# EAGLE design HeadlightPCB (EAGLE 9.5.0)
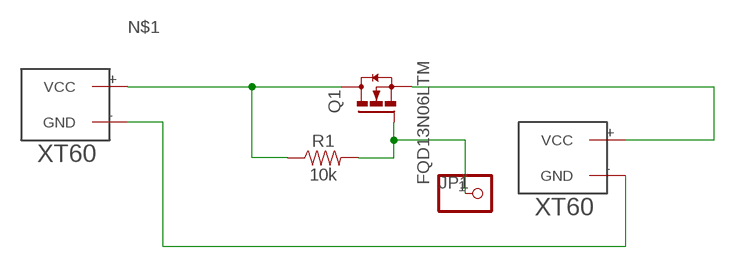
[diagram p0: schematic, sheet 1]

## Parts
JP1  PINHD-1X1  [1X01]
Q1  FQD13N06LTM  [DPAK4]
R1  10k  10KOHM-0603-1/10W-1%  [0603]
U$2  XT60  [XT60]
VIN  XT60  [XT60]

## Nets
N$1: Q1.2(D) Q1.4(D) R1.1 VIN.+(VCC)
N$3: Q1.3(S) U$2.+(VCC)
N$4: U$2.-(GND) VIN.-(GND)
N$5: JP1.1 Q1.1(G) R1.2

## Library data of the parts
JP1 = adafruit:PINHD-1X1: Pin header 1x1 for 0.1" spacing With round pins
Q1 = Transistor:FQD13N06LTM: MOSFET N-CH 60V 11A DPAK Manufacturer's datasheet <https://www.onsemi.com/pub/Collateral/FQU13N06L-D.PDF>; CREATED_BY: PCBLayout.com; DIGIKEY_PART_NUMBER: FQD13N06LTMCT-ND; MANUFACTURER: ON Semiconductor; MPN: FQD13N06LTM; PACKAGE: DPAK-4
R1 = SparkFun-Resistors:10KOHM: 10kΩ resistor A resistor is a passive two-terminal electrical component that implements electrical resistance as a circuit element. Resistors act to reduce current flow, and, at the same time, act to lower voltage levels within circuits. - Wikipedia; PROD_ID: RES-00824
U$2 VIN = XT60:XT60: XT60

## Board
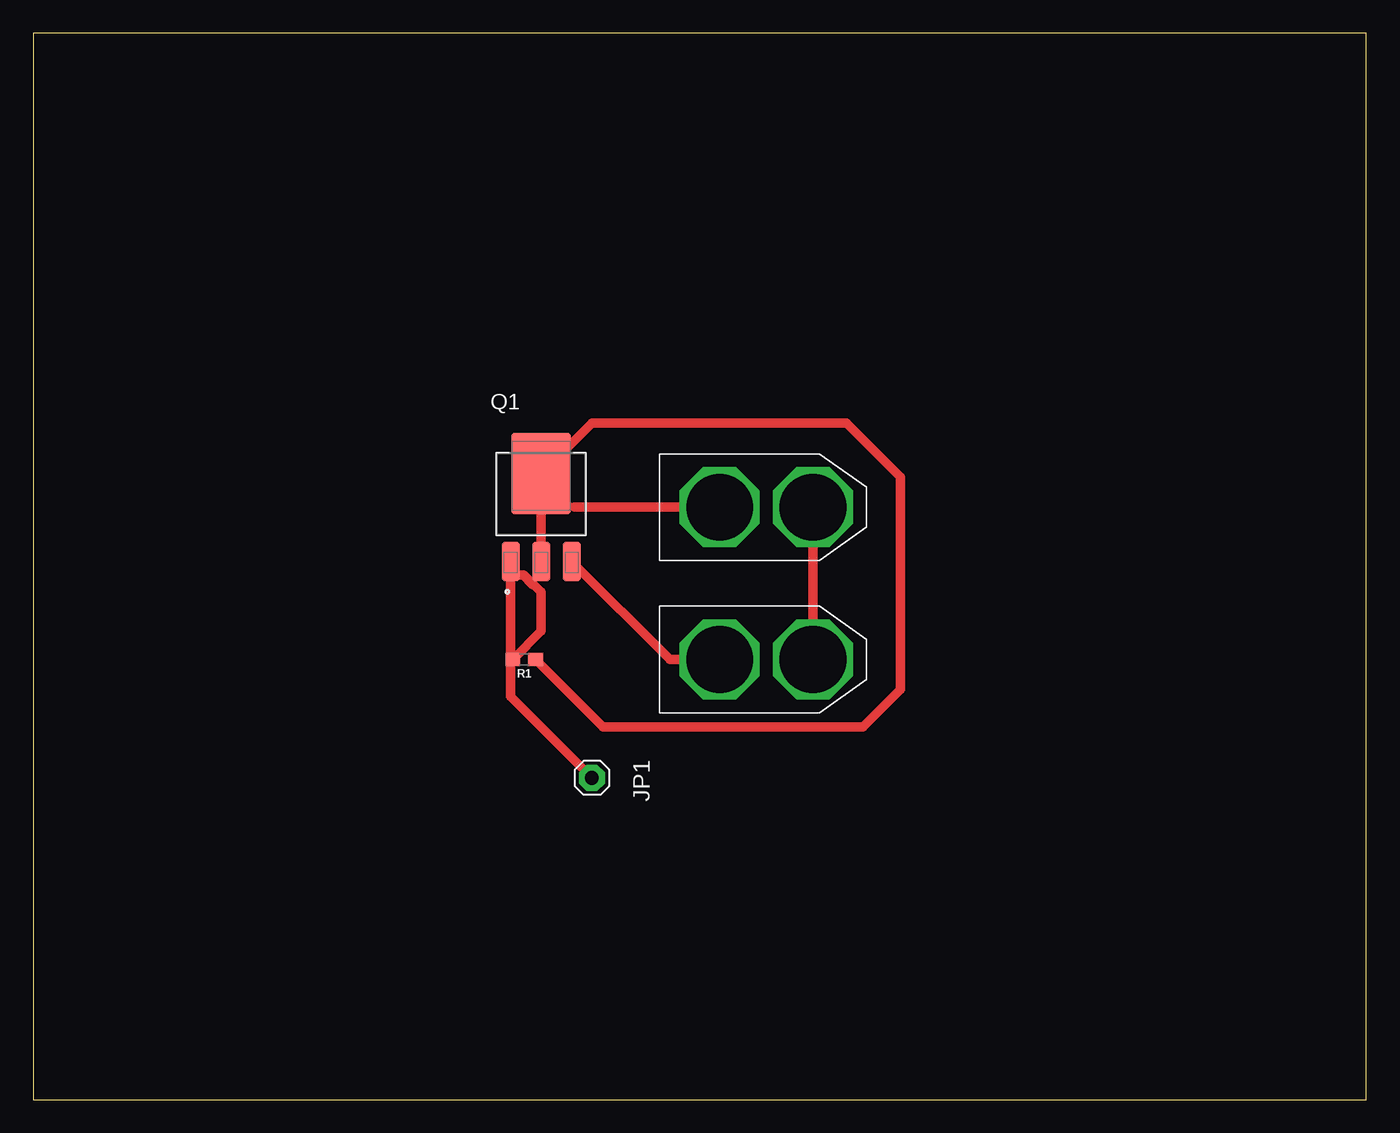
[diagram p1: board, top side]

Size 100 x 80 mm. Coordinates in mm from the lower left corner, seen from the top.
Outline: 0,0 100,0 100,80 0,80 0,0
Copper layers (1*16): Top 0.035mm / dielectric 1.5mm / Bottom 0.035mm
Design rules "default": minimum track width 6mil, minimum drill 0.35mm, track to track 6mil, track to pad 6mil, pad to pad 6mil, via to via 6mil, smd to smd 6mil, copper to edge 40mil, drill to drill 6mil, minimum pad ring 10mil, minimum via ring 8mil, stop-mask expansion 4mil, vias tented up to drill 0mil, thermal gap 10mil

### Footprints (pad centres in the part's own frame; a part is rotated, then mirrored left to right if it is on the bottom)
1X01 = drill 1.016 pad 1.93 octagon: 1 0,0
DPAK4 = smd 1.36 x 2.98: 1 -2.29,-4.07; 2 0,-4.07; 3 2.29,-4.07 | smd 4.49 x 6.1: 4 0,2.51
0603 = smd 1.1 x 1: 1 -0.85,0; 2 0.85,0
XT60 = drill 5 octagon: + 4.5,0; - 11.5,0

### Placement (x,y rotation side)
JP1  41.91,24.13 270 top
Q1  38.1,44.45 0 top
R1  36.83,33.02 180 top
U$2  46.99,33.02 0 top
VIN  46.99,44.45 0 top

### Tracks (layer width: path | path; a pad name or v marks a point on that pad's centre or on a via)
N$1
  Top 0.152: 40.61,44.45 Q1.4
  Top 0.716: VIN.+ 40.61,44.45 | R1.1 42.76,27.94 62.23,27.94 65.06,30.77 65.06,46.7 60.99,50.77 41.91,50.77 Q1.4 Q1.2
N$3
  Top 0.716: Q1.3 47.75,33.02 U$2.+
N$4
  Top 0.716: VIN.- U$2.-
N$5
  Top 0.152: Q1.1 35.81,39.37 | 37.54,38.66 37.47,38.66
  Top 0.716: JP1.1 35.81,30.23 35.81,39.37 36.76,39.37 37.47,38.66 | R1.2 38.1,35.14 38.1,38.1 37.54,38.66